# EAGLE design LEDToy (EAGLE 6.6.0)
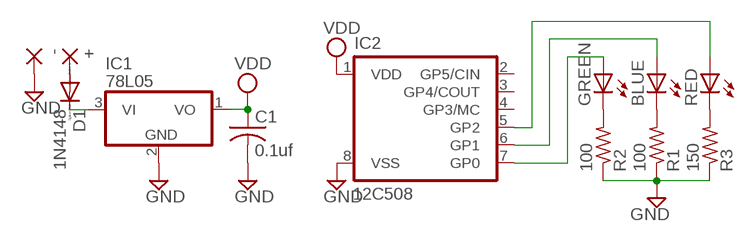
[diagram p0: schematic, sheet 1]

## Parts
+  2,15/1,0  [2,15/1,0]
-  2,15/1,0  [2,15/1,0]
BLUE  LED5MM  [LED5MM]
C1  0.1uf  C-US050-025X075  [C050-025X075]
D1  1N4148  1N4148DO35-10  [DO35-10]
GREEN  LED5MM  [LED5MM]
IC1  78L05  78L05Z  [TO92]
IC2  12C508  PIC12C508P  [DIL8]
R1  100  R-US_0207/10  [0207/10]
R2  100  R-US_0207/10  [0207/10]
R3  150  R-US_0207/10  [0207/10]
RED  LED5MM  [LED5MM]

## Nets
GND: -.1(P) C1.2 IC1.2(GND) IC2.8(VSS) R1.1 R2.1 R3.1
N$1: D1.C IC1.3(VI)
N$2: +.1(P) D1.A
N$3: R3.2 RED.K(C)
N$4: BLUE.K(C) R1.2
N$5: GREEN.K(C) R2.2
N$6: GREEN.A IC2.7(GP0)
N$7: BLUE.A IC2.6(GP1)
N$8: IC2.5(GP2) RED.A
VDD: C1.1 IC1.1(VO) IC2.1(VDD)
Unconnected: IC2.2(GP5/CIN) IC2.3(GP4/COUT) IC2.4(GP3/MC)

## Library data of the parts
+ - = wirepad:2,15/1,0: THROUGH-HOLE PAD
BLUE GREEN RED = led:LED: LED OSRAM: - CHIPLED LG R971, LG N971, LY N971, LG Q971, LY Q971, LO R971, LY R971 LH N974, LH R974 LS Q976, LO Q976, LY Q976 LO Q996 - Hyper CHIPLED LW Q18S LB Q993, LB Q99A, LB R99A - SideLED LS A670, LO A670, LY A670, LG A670, LP A670 LB A673, LV A673, LT A673, LW A673 LH A674 LY A675 LS A676, LA A676, LO A676, LY A676, LW A676 LS A679, LY A679, LG A679 - Hyper Micro SIDELED® LS Y876, LA Y876, LO Y876, LY Y876 LT Y87S - SmartLED LW L88C, LW L88S LB L89C, LB L89S, LG L890 LS L89K, LO L89K, LY L89K LS L896, LA L896, LO L896, LY L896 - TOPLED LS T670, LO T670, LY T670, LG T670, LP T670 LSG T670, LSP T670, LSY T670, LOP T670, LYG T670 LG T671, LOG T671, LSG T671 LB T673, LV T673, LT T673, LW T673 LH T674 LS T676, LA T676, LO T676, LY T676, LB T676, LH T676, LSB T676, LW T676 LB T67C, LV T67C, LT T67C, LS T67K, LO T67K, LY T67K, LW E67C LS E67B, LA E67B, LO E67B, LY E67B, LB E67C, LV E67C, LT E67C LW T67C LS T679, LY T679, LG T679 LS T770, LO T770, LY T770, LG T770, LP T770 LB T773, LV T773, LT T773, LW T773 LH T774 LS E675, LA E675, LY E675, LS T675 LS T776, LA T776, LO T776, LY T776, LB T776 LHGB T686 LT T68C, LB T68C - Hyper Mini TOPLED® LB M676 - Mini TOPLED Santana® LG M470 LS M47K, LO M47K, LY M47K Source: http://www.osram.convergy.de LUXEON: - LUMILED® LXK2-PW12-R00, LXK2-PW12-S00, LXK2-PW14-U00, LXK2-PW14-V00 LXK2-PM12-R00, LXK2-PM12-S00, LXK2-PM14-U00 LXK2-PE12-Q00, LXK2-PE12-R00, LXK2-PE12-S00, LXK2-PE14-T00, LXK2-PE14-U00 LXK2-PB12-K00, LXK2-PB12-L00, LXK2-PB12-M00, LXK2-PB14-N00, LXK2-PB14-P00, LXK2-PB14-Q00 LXK2-PR12-L00, LXK2-PR12-M00, LXK2-PR14-Q00, LXK2-PR14-R00 LXK2-PD12-Q00, LXK2-PD12-R00, LXK2-PD12-S00 LXK2-PH12-R00, LXK2-PH12-S00 LXK2-PL12-P00, LXK2-PL12-Q00, LXK2-PL12-R00 Source: www.luxeon.com KINGBRIGHT: KA-3528ASYC Source: www.kingbright.com
C1 = rcl:C-US: CAPACITOR, American symbol
D1 = diode:1N4148: DIODE high speed (Philips)
IC1 = linear:78*: Positive VOLTAGE REGULATOR Source: http://cache.national.com/ds/LM/LM78L05.pdf http://www.fairchildsemi.com/ds/LM/LM7805.pdf
IC2 = microchip:PIC12C*?: MICROCONTROLLER; MF: MICROCHIP; MPN: PIC12C508A-04I/P; OC_FARNELL: 9758763; OC_NEWARK: 12C1849
R1-R3 = rcl:R-US_: RESISTOR, American symbol

## Board
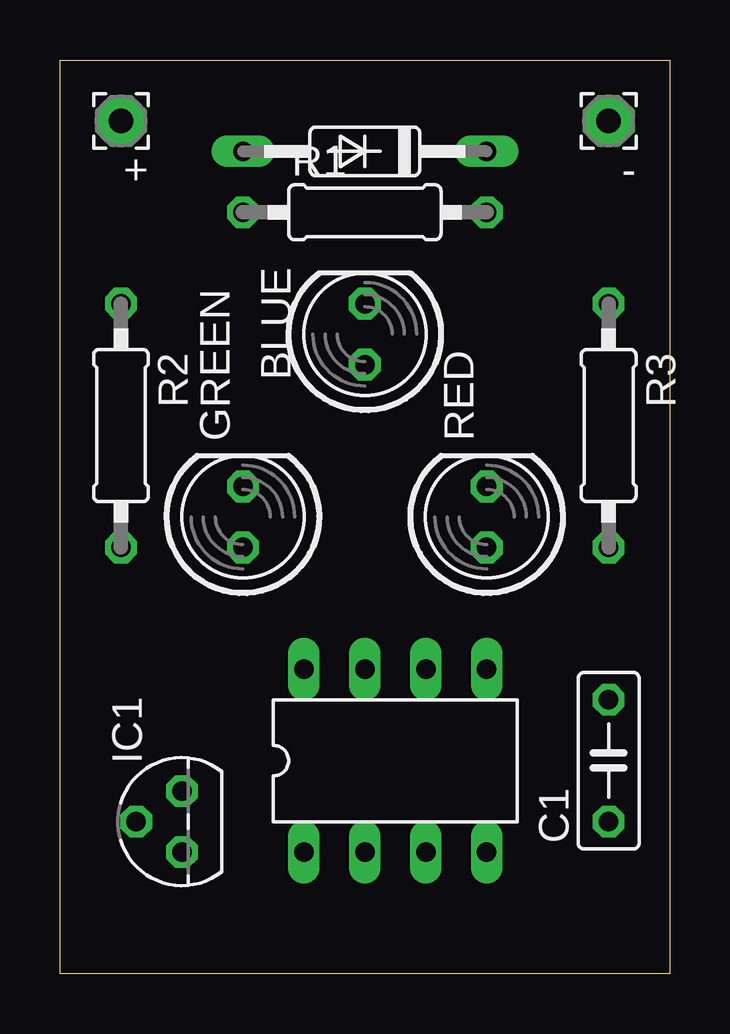
[diagram p1: board, top side]
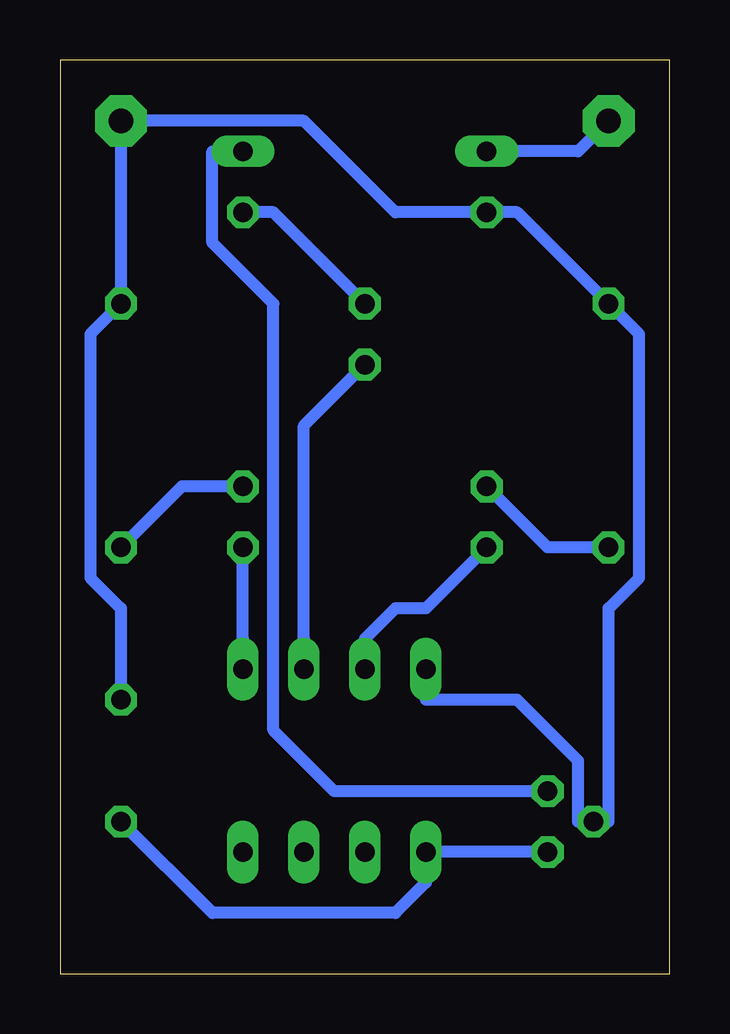
[diagram p2: board, bottom side, seen from below]

Size 25.4 x 38.1 mm. Coordinates in mm from the lower left corner, seen from the top.
Outline: 0,0 0,38.1 25.4,38.1 25.4,0 0,0
Copper layers (1+16): Top 0.035mm / dielectric 1.5mm / Bottom 0.035mm
Design rules "16mils": minimum track width 16mil, minimum drill 32mil, track to track 15mil, track to pad 10mil, pad to pad 10mil, via to via 10mil, smd to smd 10mil, copper to edge 13mil, drill to drill 10mil, minimum pad ring 10mil, minimum via ring 8mil, stop-mask expansion 0mil, vias tented up to drill 0mil, thermal gap 10mil

### Footprints (pad centres in the part's own frame; a part is rotated, then mirrored left to right if it is on the bottom)
2,15/1,0 = drill 1.016 pad 2.159 octagon: 1 0,0
LED5MM = drill 0.813 octagon: A -1.27,0; K 1.27,0
C050-025X075 = drill 0.813 octagon: 1 -2.54,0; 2 2.54,0
DO35-10 = drill 0.813 long: A 5.08,0; C -5.08,0
TO92 = drill 0.813 octagon: 1 -1.27,0; 2 0,1.905; 3 1.27,0
DIL8 = drill 0.813 long: 1 -3.81,-3.81; 2 -1.27,-3.81; 3 1.27,-3.81; 4 3.81,-3.81; 5 3.81,3.81; 6 1.27,3.81; 7 -1.27,3.81; 8 -3.81,3.81
0207/10 = drill 0.813 octagon: 1 -5.08,0; 2 5.08,0

### Placement (x,y rotation side)
+  2.54,35.56 180 top
-  22.86,35.56 180 top
BLUE  12.7,26.67 90 top
C1  22.86,8.89 90 top
D1  12.7,34.29 180 top
GREEN  7.62,19.05 90 top
IC1  5.08,6.35 90 top
IC2  13.97,8.89 0 top
R1  12.7,31.75 0 top
R2  2.54,22.86 270 top
R3  22.86,22.86 270 top
RED  17.78,19.05 90 top

### Tracks (layer width: path | path; a pad name or v marks a point on that pad's centre or on a via)
GND
  Bottom 0.508: IC2.8 10.16,11.43 6.35,11.43 3.81,8.89 3.81,6.35 IC1.2 2.54,6.35 2.54,15.24 1.27,16.51 1.27,26.67 R2.1 6.35,31.75 R1.1 11.43,31.75 15.24,35.56 -.1 R3.1 24.13,26.67 24.13,16.51 22.86,15.24 C1.2
N$1
  Bottom 0.508: IC1.3 13.97,7.62 16.51,10.16 16.51,27.94 19.05,30.48 19.05,34.29 D1.C
N$2
  Bottom 0.508: +.1 3.81,34.29 6.35,34.29 D1.A
N$3
  Bottom 0.508: RED.K 20.32,20.32 R3.2
N$4
  Bottom 0.508: BLUE.K 16.51,31.75 R1.2
N$5
  Bottom 0.508: R2.2 5.08,17.78 GREEN.K
N$6
  Bottom 0.508: GREEN.A 10.16,15.24 11.43,15.24 12.7,13.97 IC2.7
N$7
  Bottom 0.508: BLUE.A 15.24,22.86 15.24,13.97 IC2.6
N$8
  Bottom 0.508: RED.A 17.78,13.97 IC2.5
VDD
  Bottom 0.508: IC1.1 IC2.1 10.16,3.81 11.43,2.54 19.05,2.54 C1.1